# EAGLE schematic uC-Board (EAGLE 7.5.0)
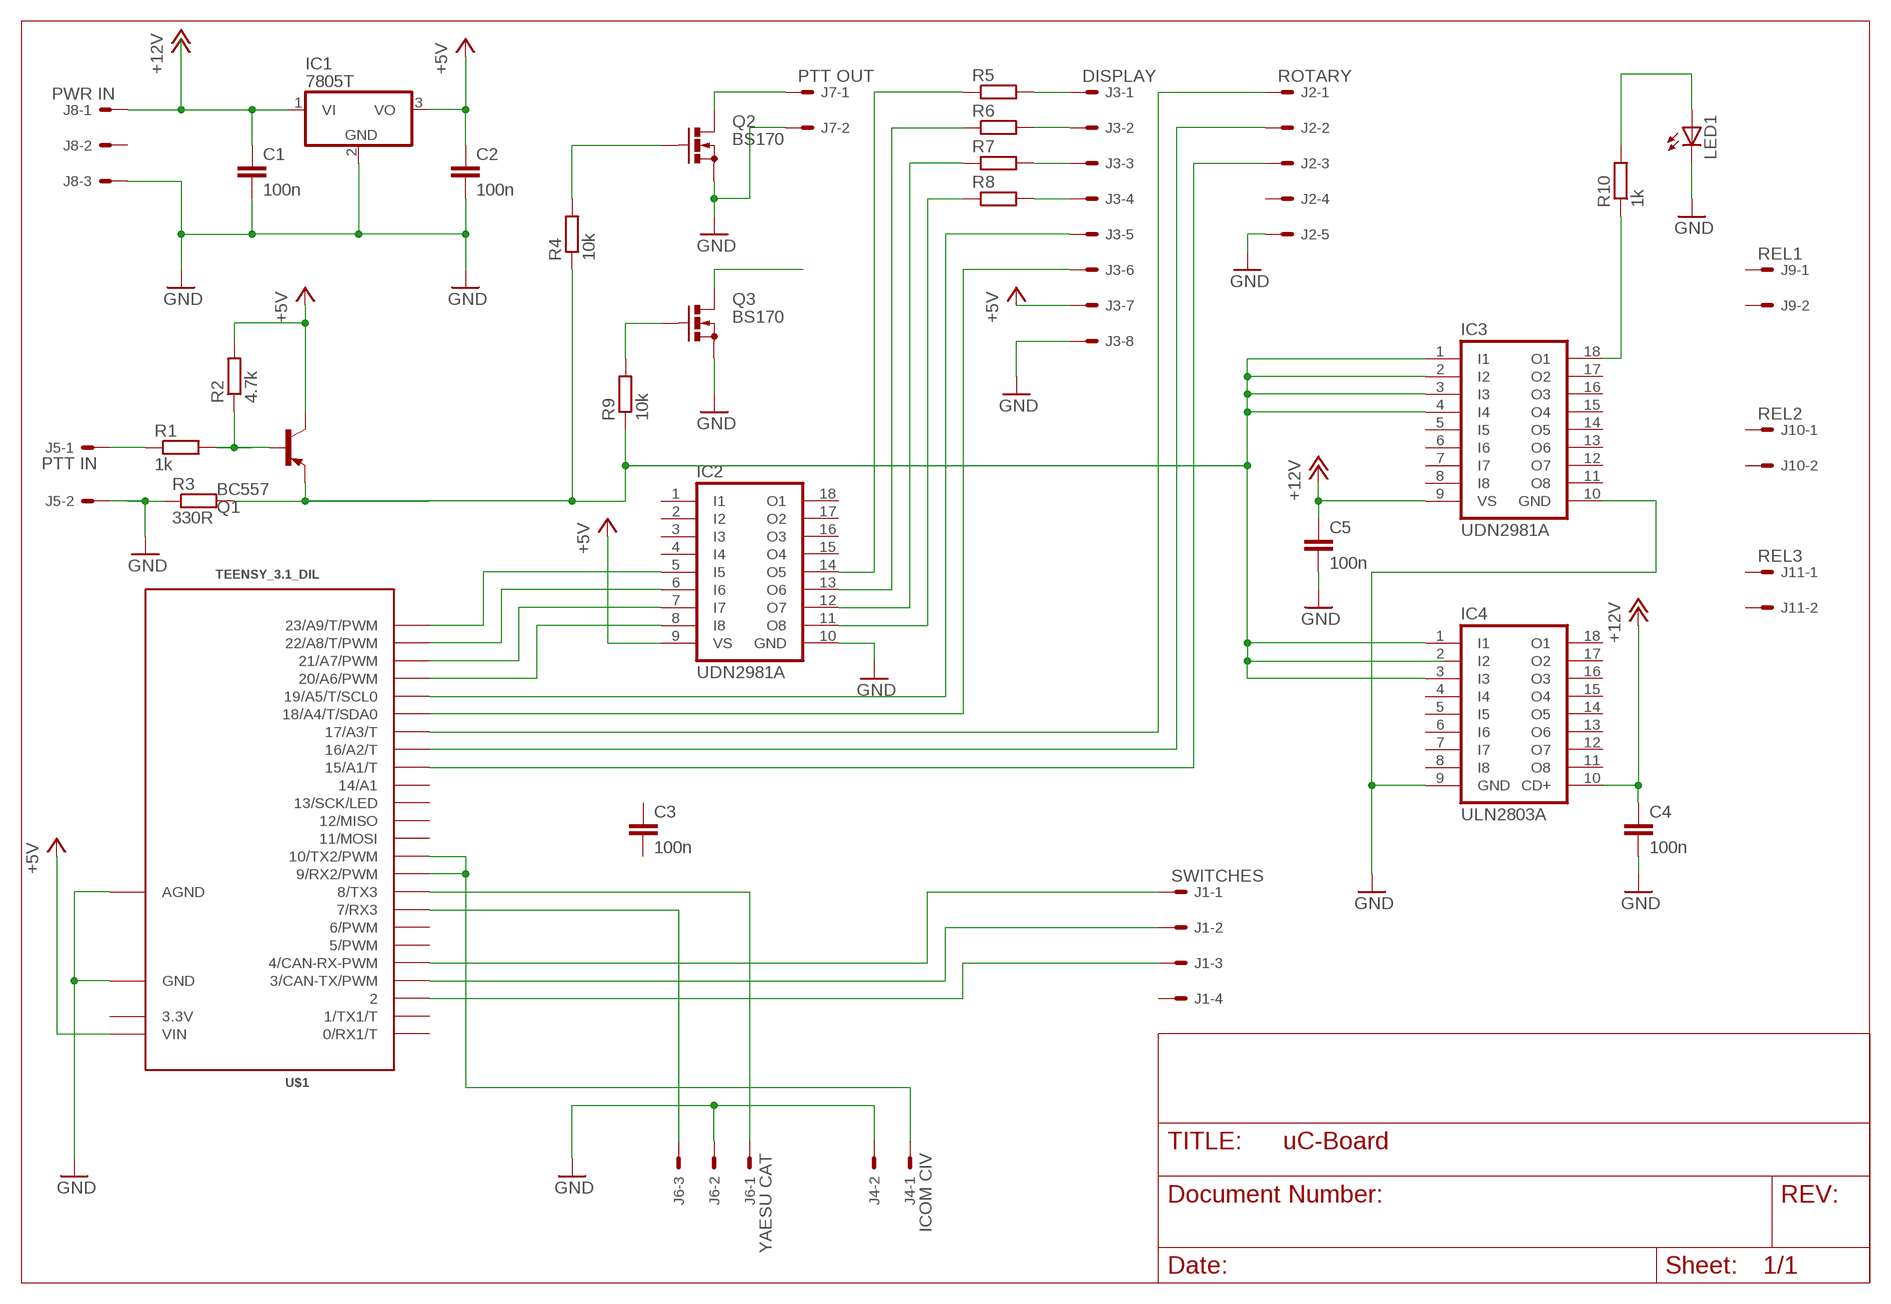
[diagram p0: schematic, sheet 1]

## Parts
C1  100n  C-EU025-025X050  [C025-025X050]
C2  100n  C-EU025-025X050  [C025-025X050]
C3  100n  C-EU025-025X050  [C025-025X050]
C4  100n  C-EU025-025X050  [C025-025X050]
C5  100n  C-EU025-025X050  [C025-025X050]
IC1  7805T  [TO220H]
IC2  UDN2981A  [DIL18]
IC3  UDN2981A  [DIL18]
IC4  ULN2803A  [DIL18]
J1  SWITCHES  22-27-2041-04  [6410-04]
J2  ROTARY  22-27-2051-05  [6410-05]
J3  DISPLAY  22-27-2081-08  [6410-08]
J4  ICOM CIV  22-27-2021-02  [6410-02]
J5  PTT IN  22-27-2021-02  [6410-02]
J6  YAESU CAT  22-27-2031-03  [6410-03]
J7  PTT OUT  22-27-2021-02  [6410-02]
J8  PWR IN  22-23-2031  [22-23-2031]
J9  REL1  22-27-2021-02  [6410-02]
J10  REL2  22-27-2021-02  [6410-02]
J11  REL3  22-27-2021-02  [6410-02]
LED1  LED5MM  [LED5MM]
Q1  BC557  [TO92]
Q2  BS170  [SOT54E]
Q3  BS170  [SOT54E]
R1  1k  R-EU_0207/10  [0207/10]
R2  4.7k  R-EU_0207/10  [0207/10]
R3  330R  R-EU_0207/10  [0207/10]
R4  10k  R-EU_0207/10  [0207/10]
R5  R-EU_0207/10  [0207/10]
R6  R-EU_0207/10  [0207/10]
R7  R-EU_0207/10  [0207/10]
R8  R-EU_0207/10  [0207/10]
R9  10k  R-EU_0207/10  [0207/10]
R10  1k  R-EU_0207/10  [0207/10]
U$1  TEENSY_3.1_DIL  [TEENSY3-DIL]

## Nets
+5V: C2.1 IC1.3(VO) IC2.9(VS) J3.7 Q1.3(C) R2.2 U$1.VIN
+12V: C1.1 C4.1 C5.1 IC1.1(VI) IC3.9(VS) IC4.10(CD+) J8.1
GND: C1.2 C2.2 C4.2 C5.2 IC1.2(GND) IC2.10(GND) IC3.10(GND) IC4.9(GND) J2.5 J3.8 J4.2 J5.2 J6.2 J7.2 J8.3 LED1.K(C) Q2.S Q3.S R3.1 U$1.AGND U$1.GND
N$1: J3.6 U$1.18/A4(18/A4/T/SDA0)
N$2: J3.5 U$1.19/A5(19/A5/T/SCL0)
N$3: IC2.11(O8) R8.1
N$4: J4.1 U$1.9(9/RX2/PWM) U$1.10(10/TX2/PWM)
N$5: J6.1 U$1.8(8/TX3)
N$6: J6.3 U$1.7(7/RX3)
N$7: IC2.12(O7) R7.1
N$8: IC2.13(O6) R6.1
N$9: IC2.14(O5) R5.1
N$10: Q1.2(B) R1.2 R2.1
N$12: J5.1 R1.1
N$13: J1.1 U$1.4(4/CAN-RX-PWM)
N$14: Q2.G R4.2
N$15: J7.1 Q2.D
N$16: J2.1 U$1.17/A3(17/A3/T)
N$17: J2.2 U$1.16/A2(16/A2/T)
N$18: J2.3 U$1.15/A1(15/A1/T)
N$19: J1.2 U$1.3(3/CAN-TX/PWM)
N$20: J1.3 U$1.2
N$21: IC2.5(I5) U$1.23/A9(23/A9/T/PWM)
N$22: IC2.6(I6) U$1.22/A8(22/A8/T/PWM)
N$23: IC2.7(I7) U$1.21/A7(21/A7/PWM)
N$24: IC2.8(I8) U$1.20/A6(20/A6/PWM)
N$25: J3.4 R8.2
N$26: J3.3 R7.2
N$27: J3.2 R6.2
N$28: J3.1 R5.2
N$29: Q3.G R9.2
N$30: Q3.D
N$31: LED1.A R10.2
N$32: IC3.18(O1) R10.1
N$34: IC3.1(I1) IC3.2(I2) IC3.3(I3) IC3.4(I4) IC4.1(I1) IC4.3(I3) Q1.1(E) R3.2 R4.1 R9.1
Unconnected: C3.1 C3.2 IC2.1(I1) IC2.2(I2) IC2.3(I3) IC2.4(I4) IC2.15(O4) IC2.16(O3) IC2.17(O2) IC2.18(O1) IC3.5(I5) IC3.6(I6) IC3.7(I7) IC3.8(I8) IC3.11(O8) IC3.12(O7) IC3.13(O6) IC3.14(O5) IC3.15(O4) IC3.16(O3) IC3.17(O2) IC4.2(I2) IC4.4(I4) IC4.5(I5) IC4.6(I6) IC4.7(I7) IC4.8(I8) IC4.11(O8) IC4.12(O7) IC4.13(O6) IC4.14(O5) IC4.15(O4) IC4.16(O3) IC4.17(O2) IC4.18(O1) J1.4 J2.4 J8.2 J9.1 J9.2 J10.1 J10.2 J11.1 J11.2 U$1.0(0/RX1/T) U$1.1(1/TX1/T) U$1.5(5/PWM) U$1.6(6/PWM) U$1.11(11/MOSI) U$1.12(12/MISO) U$1.13(13/SCK/LED) U$1.14/A0(14/A1)

## Power pins joined to a net without a drawn wire
3.3V: U$1.3.3V

## Library data of the parts
C1-C5 = rcl:C-EU: CAPACITOR, European symbol
IC1 = linear:78*: Positive VOLTAGE REGULATOR Source: http://cache.national.com/ds/LM/LM78L05.pdf http://www.fairchildsemi.com/ds/LM/LM7805.pdf
IC2 IC3 = uln-udn:UDN298*: DRIVER ARRAY Source: Allegro Microsystems Inc. / UDN2981-UDN2984.pdf
IC4 = uln-udn:ULN2803A: DRIVER ARRAY
J1 = con-molex:22-?-04: CONNECTOR wire to board 2.54 mm (.1 inch) pitch header; OC_FARNELL: unknown; OC_NEWARK: unknown
J2 = con-molex:22-?-05: CONNECTOR wire to board 2.54 mm (.1 inch) pitch header; OC_FARNELL: unknown; OC_NEWARK: unknown
J3 = con-molex:22-?-08: CONNECTOR wire to board 2.54 mm (.1 inch) pitch header; OC_FARNELL: unknown; OC_NEWARK: unknown
J4 J5 J7 J9-J11 = con-molex:22-?-02: CONNECTOR wire to board 2.54 mm (.1 inch) pitch header; OC_FARNELL: unknown; OC_NEWARK: unknown
J6 = con-molex:22-?-03: CONNECTOR wire to board 2.54 mm (.1 inch) pitch header; OC_FARNELL: unknown; OC_NEWARK: unknown
J8 = con-molex:22-23-2031: .100" (2.54mm) Center Header - 3 Pin; MF: MOLEX; MPN: 22-23-2031; OC_FARNELL: 1462950; OC_NEWARK: 30C0862
LED1 = led:LED: LED OSRAM: - CHIPLED LG R971, LG N971, LY N971, LG Q971, LY Q971, LO R971, LY R971 LH N974, LH R974 LS Q976, LO Q976, LY Q976 LO Q996 - Hyper CHIPLED LW Q18S LB Q993, LB Q99A, LB R99A - SideLED LS A670, LO A670, LY A670, LG A670, LP A670 LB A673, LV A673, LT A673, LW A673 LH A674 LY A675 LS A676, LA A676, LO A676, LY A676, LW A676 LS A679, LY A679, LG A679 - Hyper Micro SIDELED® LS Y876, LA Y876, LO Y876, LY Y876 LT Y87S - SmartLED LW L88C, LW L88S LB L89C, LB L89S, LG L890 LS L89K, LO L89K, LY L89K LS L896, LA L896, LO L896, LY L896 - TOPLED LS T670, LO T670, LY T670, LG T670, LP T670 LSG T670, LSP T670, LSY T670, LOP T670, LYG T670 LG T671, LOG T671, LSG T671 LB T673, LV T673, LT T673, LW T673 LH T674 LS T676, LA T676, LO T676, LY T676, LB T676, LH T676, LSB T676, LW T676 LB T67C, LV T67C, LT T67C, LS T67K, LO T67K, LY T67K, LW E67C LS E67B, LA E67B, LO E67B, LY E67B, LB E67C, LV E67C, LT E67C LW T67C LS T679, LY T679, LG T679 LS T770, LO T770, LY T770, LG T770, LP T770 LB T773, LV T773, LT T773, LW T773 LH T774 LS E675, LA E675, LY E675, LS T675 LS T776, LA T776, LO T776, LY T776, LB T776 LHGB T686 LT T68C, LB T68C - Hyper Mini TOPLED® LB M676 - Mini TOPLED Santana® LG M470 LS M47K, LO M47K, LY M47K Source: http://www.osram.convergy.de LUXEON: - LUMILED® LXK2-PW12-R00, LXK2-PW12-S00, LXK2-PW14-U00, LXK2-PW14-V00 LXK2-PM12-R00, LXK2-PM12-S00, LXK2-PM14-U00 LXK2-PE12-Q00, LXK2-PE12-R00, LXK2-PE12-S00, LXK2-PE14-T00, LXK2-PE14-U00 LXK2-PB12-K00, LXK2-PB12-L00, LXK2-PB12-M00, LXK2-PB14-N00, LXK2-PB14-P00, LXK2-PB14-Q00 LXK2-PR12-L00, LXK2-PR12-M00, LXK2-PR14-Q00, LXK2-PR14-R00 LXK2-PD12-Q00, LXK2-PD12-R00, LXK2-PD12-S00 LXK2-PH12-R00, LXK2-PH12-S00 LXK2-PL12-P00, LXK2-PL12-Q00, LXK2-PL12-R00 Source: www.luxeon.com KINGBRIGHT: KA-3528ASYC Source: www.kingbright.com
Q1 = transistor-pnp:BC557: PNP Transistor
Q2 Q3 = transistor-small-signal:BS170: N-CHANNEL MOS FET
R1-R10 = rcl:R-EU_: RESISTOR, European symbol
U$1 = Teensy_3_and_LC_Series_Boards_v1.1:TEENSY_3.1_DIL: Teensy 3.1 or 3.2 in a DIL Layout.